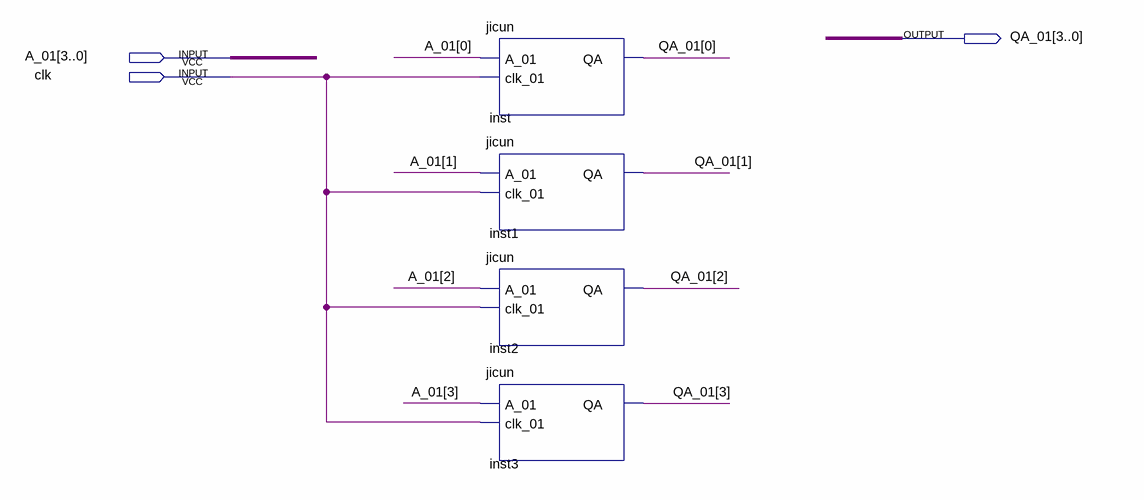
[diagram p0: schematic sheet]
// Quartus schematic jicun4.bdf as structural Verilog: 4 symbols, 3 pins
module jicun4 (
  input  [3:0] A_01,
  input  clk,
  output [3:0] QA_01
);

  jicun inst (.A_01(A_01[0]), .clk_01(clk), .QA(QA_01[0]));
  jicun inst1 (.A_01(A_01[1]), .clk_01(clk), .QA(QA_01[1]));
  jicun inst2 (.A_01(A_01[2]), .clk_01(clk), .QA(QA_01[2]));
  jicun inst3 (.A_01(A_01[3]), .clk_01(clk), .QA(QA_01[3]));
endmodule
